# EAGLE design workshop (EAGLE 8.4.0)
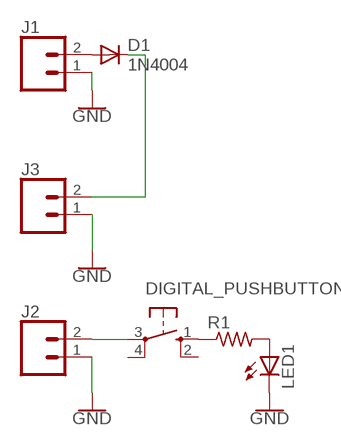
[diagram p0: schematic, sheet 1]

## Parts
D1  1N4004  [DO41-10]
DIGITAL_PUSHBUTTON  10-XX  [B3F-10XX]
J1  CONN_02  [1X02]
J2  CONN_02  [1X02]
J3  CONN_02  [1X02]
LED1  LED5MM  [LED5MM]
R1  R-US_0309/12  [0309/12]

## Nets
GND: J1.1 J2.1 J3.1 LED1.K(C)
N$1: LED1.A R1.2
N$2: DIGITAL_PUSHBUTTON.3(P) J2.2
N$3: D1.A J1.2
N$4: D1.C J3.2
N$5: DIGITAL_PUSHBUTTON.1(S) R1.1
Unconnected: DIGITAL_PUSHBUTTON.2(S1) DIGITAL_PUSHBUTTON.4(P1)

## Library data of the parts
D1 = adafruit:1N4004: DIODE General purpose 1N400x type rectifier (With bigger pads) http://www.ladyada.net/library/pcb/eaglelibrary.html
DIGITAL_PUSHBUTTON = switch-omron:10-XX: OMRON SWITCH; MPN: B3F-1000; OC_FARNELL: 176432; OC_NEWARK: 36M3542
J1-J3 = SparkFun-Connectors:CONN_02: Multi connection point. Often used as Generic Header-pin footprint for 0.1 inch spaced/style header connections On any of the 0.1 inch spaced packages, you can populate with these: Break Away Headers - Straight <https://www.sparkfun.com/products/116> (PRT-00116) Break Away Male Headers - Right Angle <https://www.sparkfun.com/products/553> (PRT-00553) Female Headers <https://www.sparkfun.com/products/115> (PRT-00115) Break Away Headers - Machine Pin <https://www.sparkfun.com/products/117> (PRT-00117) Break Away Female Headers - Swiss Machine Pin <https://www.sparkfun.com/products/743> (PRT-00743) For SCREWTERMINALS and SPRING TERMINALS visit here: Screw Terimnals on SparkFun.com <https://www.sparkfun.com/search/results?term=Screw+Terminals> (5mm/3.5mm/2.54mm spacing) This device is also useful as a general connection point to wire up your design to another part of your project. Our various solder wires solder well into these plated through hole pads. Hook-Up Wire - Assortment (Stranded, 22 AWG) <https://www.sparkfun.com/products/11375> (PRT-11375) Hook-Up Wire - Assortment (Solid Core, 22 AWG) <https://www.sparkfun.com/products/11367> (PRT-11367) View the entire wire category on our website here <https://www.sparkfun.com/categories/141> Special notes: Molex polarized connector foot print use with: PRT-08233 with associated crimp pins and housings. 2.54_SCREWTERM for use with PRT-10571. 3.5mm Screw Terminal footprints for PRT-08084 5mm Screw Terminal footprints for use with PRT-08432
LED1 = adafruit:LED: LED OSRAM: - CHIPLED LG R971, LG N971, LY N971, LG Q971, LY Q971, LO R971, LY R971 LH N974, LH R974 LS Q976, LO Q976, LY Q976 LO Q996 - Hyper CHIPLED LW Q18S LB Q993, LB Q99A, LB R99A - SideLED LS A670, LO A670, LY A670, LG A670, LP A670 LB A673, LV A673, LT A673, LW A673 LH A674 LY A675 LS A676, LA A676, LO A676, LY A676, LW A676 LS A679, LY A679, LG A679 - Hyper Micro SIDELED® LS Y876, LA Y876, LO Y876, LY Y876 LT Y87S - SmartLED LW L88C, LW L88S LB L89C, LB L89S, LG L890 LS L89K, LO L89K, LY L89K LS L896, LA L896, LO L896, LY L896 - TOPLED LS T670, LO T670, LY T670, LG T670, LP T670 LSG T670, LSP T670, LSY T670, LOP T670, LYG T670 LG T671, LOG T671, LSG T671 LB T673, LV T673, LT T673, LW T673 LH T674 LS T676, LA T676, LO T676, LY T676, LB T676, LH T676, LSB T676, LW T676 LB T67C, LV T67C, LT T67C, LS T67K, LO T67K, LY T67K, LW E67C LS E67B, LA E67B, LO E67B, LY E67B, LB E67C, LV E67C, LT E67C LW T67C LS T679, LY T679, LG T679 LS T770, LO T770, LY T770, LG T770, LP T770 LB T773, LV T773, LT T773, LW T773 LH T774 LS E675, LA E675, LY E675, LS T675 LS T776, LA T776, LO T776, LY T776, LB T776 LHGB T686 LT T68C, LB T68C - Hyper Mini TOPLED® LB M676 - Mini TOPLED Santana® LG M470 LS M47K, LO M47K, LY M47K Source: http://www.osram.convergy.de/
R1 = adafruit:R-US_: RESISTOR, American symbol

## Board
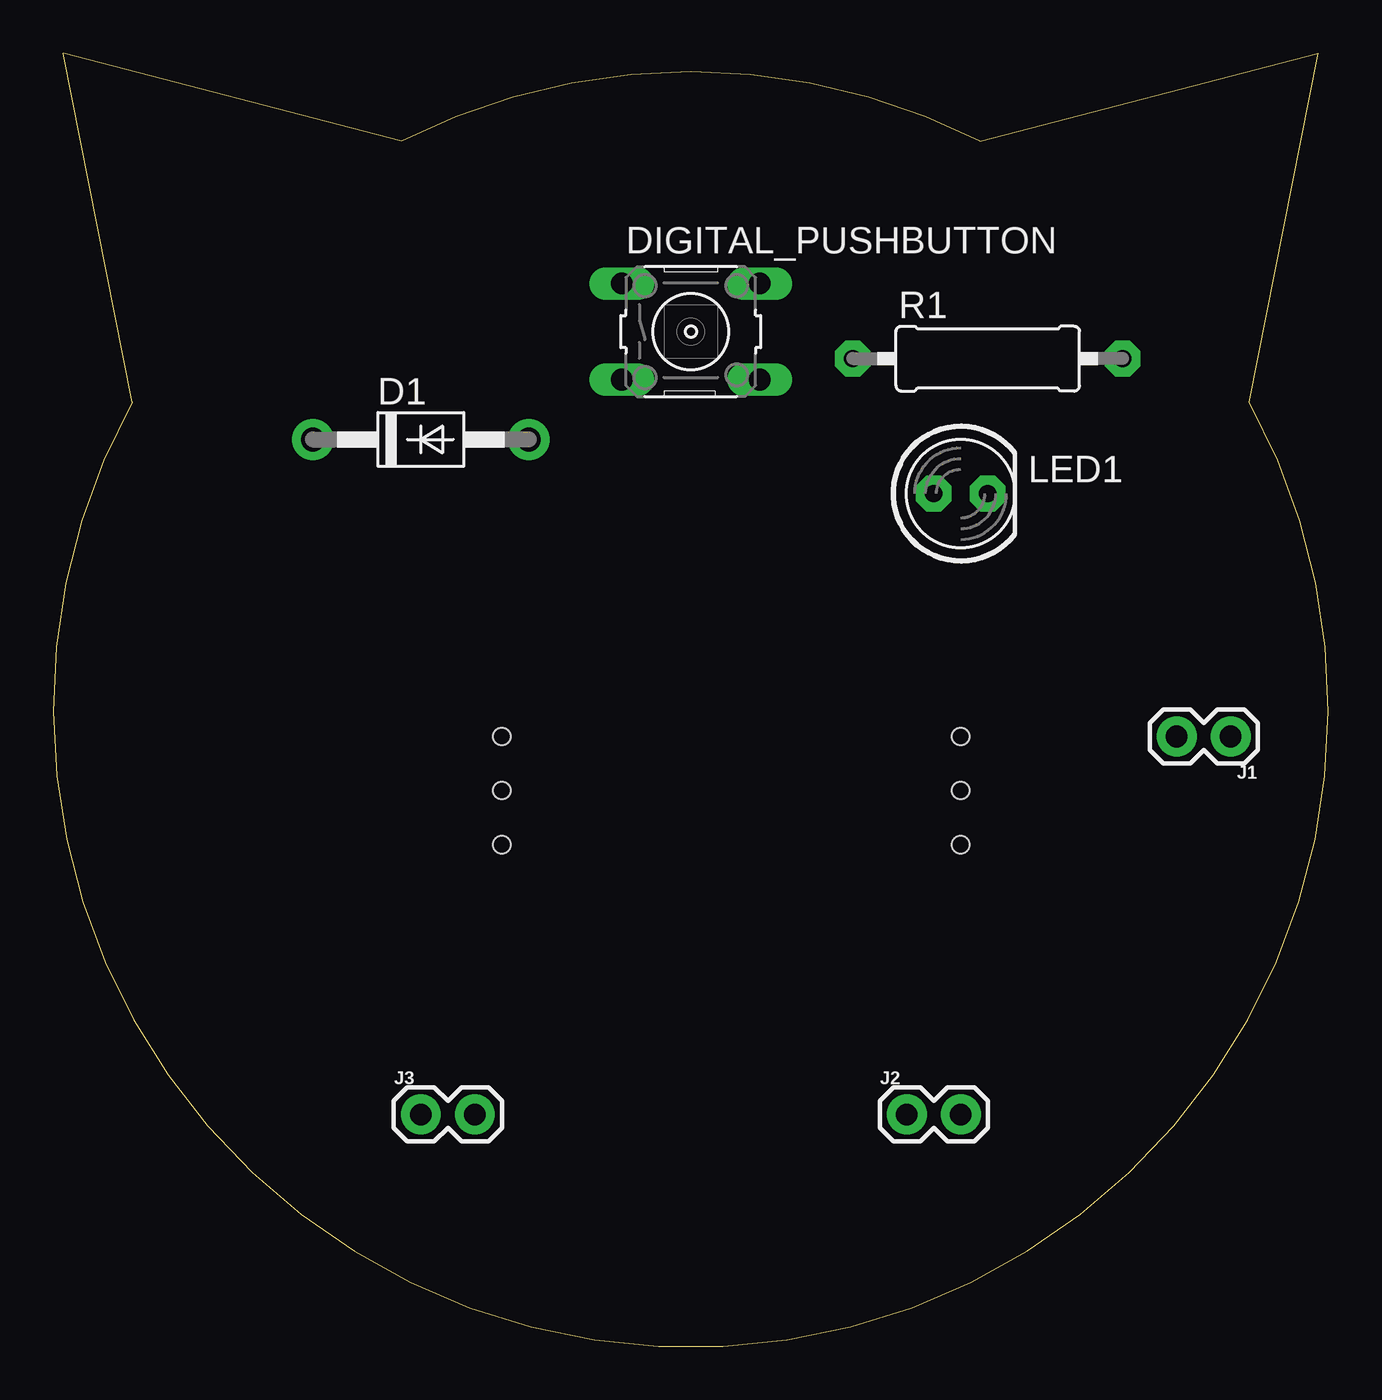
[diagram p1: board, top side]
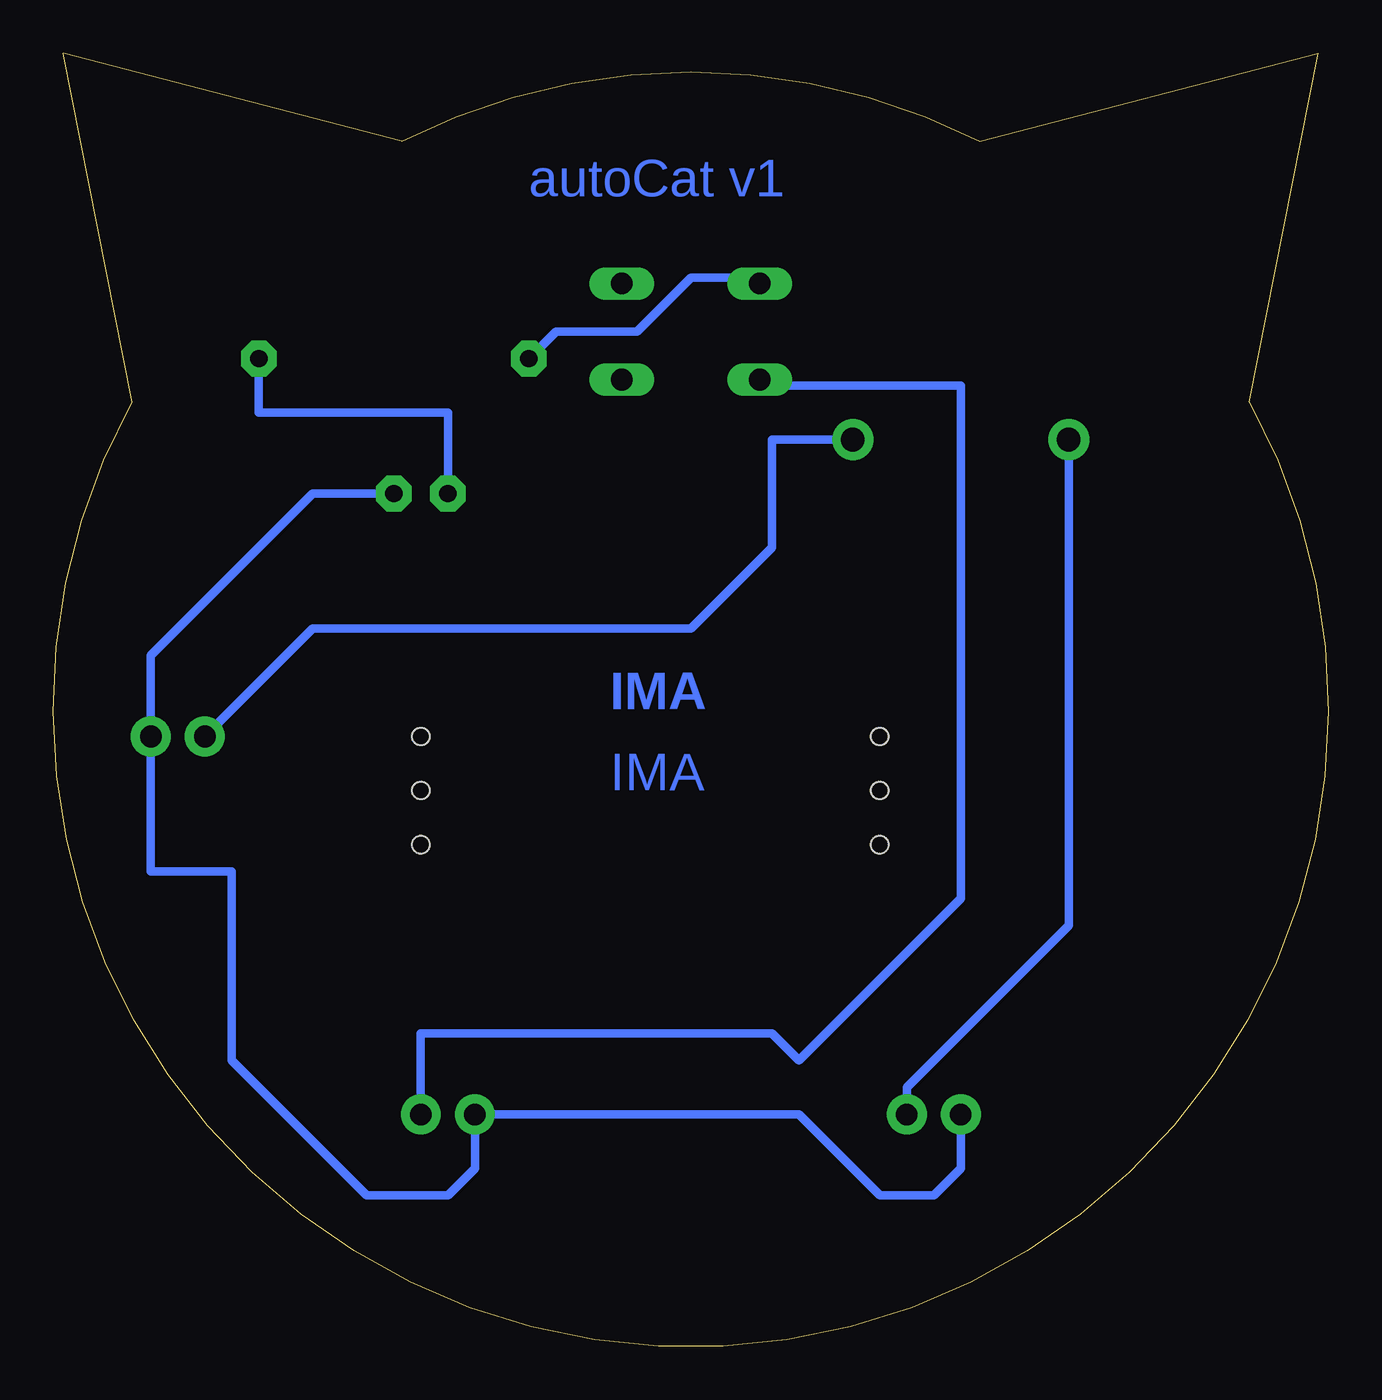
[diagram p2: board, bottom side, seen from below]

Size 60 x 60.84 mm. Coordinates in mm from the lower left corner, seen from the top.
Outline: 3.71,44.42 arc238 56.29,44.42 59.52,60.84 43.6,56.7 arc54 16.4,56.7 0.48,60.84 3.71,44.42
Copper layers (1*16): Top 0.035mm / dielectric 1.5mm / Bottom 0.035mm
Design rules "default": minimum track width 6mil, minimum drill 0.35mm, track to track 6mil, track to pad 6mil, pad to pad 6mil, via to via 6mil, smd to smd 6mil, copper to edge 40mil, drill to drill 6mil, minimum pad ring 10mil, minimum via ring 8mil, stop-mask expansion 4mil, vias tented up to drill 0mil, thermal gap 10mil
Holes 0.81 mm at 21.11,28.69 21.11,26.15 21.11,23.61 42.7,28.69 42.7,26.15 42.7,23.61

### Footprints (pad centres in the part's own frame; a part is rotated, then mirrored left to right if it is on the bottom)
DO41-10 = drill 1.118 pad 1.93: A 5.08,0; C -5.08,0
B3F-10XX = drill 1.016 long: 1 -3.251,2.261; 2 3.251,2.261; 3 -3.251,-2.261; 4 3.251,-2.261
1X02 = drill 1.016 pad 1.88: 1 0,0; 2 2.54,0
LED5MM = drill 0.813 pad 1.676 octagon: A -1.27,0; K 1.27,0
0309/12 = drill 0.813 pad 1.676 octagon: 1 -6.35,0; 2 6.35,0

### Placement (x,y rotation side)
D1  17.3,42.66 0 top
DIGITAL_PUSHBUTTON  30,47.74 0 top
J1  55.4,28.69 180 top
J2  40.16,10.91 0 top
J3  17.3,10.91 0 top
LED1  42.7,40.12 0 top
R1  43.97,46.47 0 top

### Tracks (layer width: path | path; a pad name or v marks a point on that pad's centre or on a via)
GND
  Bottom 0.406: J3.1 17.3,8.37 18.57,7.1 21.11,7.1 24.92,10.91 J2.1 40.16,8.37 41.43,7.1 45.24,7.1 51.59,13.45 51.59,22.34 55.4,22.34 J1.1 55.4,32.5 47.78,40.12 LED1.K
N$1
  Bottom 0.406: LED1.A 41.43,43.93 50.32,43.93 R1.2
N$2
  Bottom 0.406: DIGITAL_PUSHBUTTON.3 26.19,45.2 17.3,45.2 17.3,21.07 24.92,13.45 26.19,14.72 42.7,14.72 J2.2
N$3
  Bottom 0.406: J1.2 47.78,33.77 30,33.77 26.19,37.58 26.19,42.66 D1.A
N$4
  Bottom 0.406: D1.C 12.22,19.8 19.84,12.18 J3.2
N$5
  Bottom 0.406: R1.1 36.35,47.74 32.54,47.74 30,50.28 27.46,50.28 DIGITAL_PUSHBUTTON.1

### Text on the board
Bottom: autoCat v1 | IMA | IMA